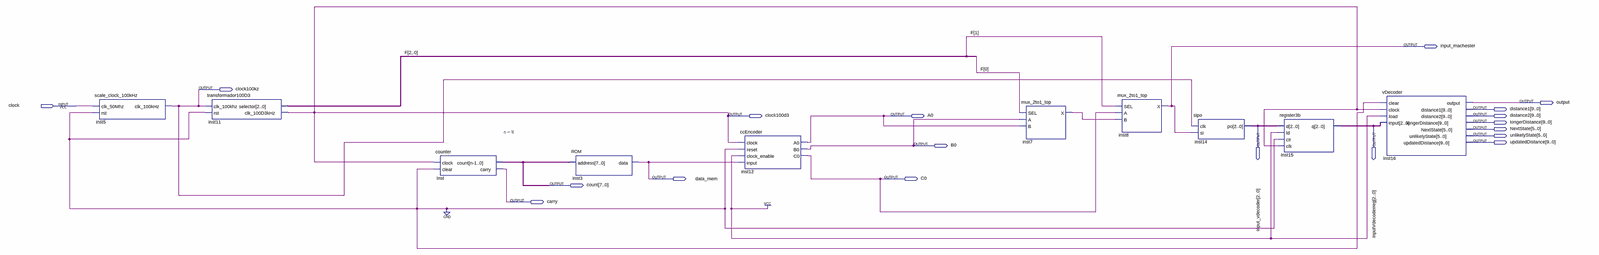
[diagram p0: schematic sheet, whole]
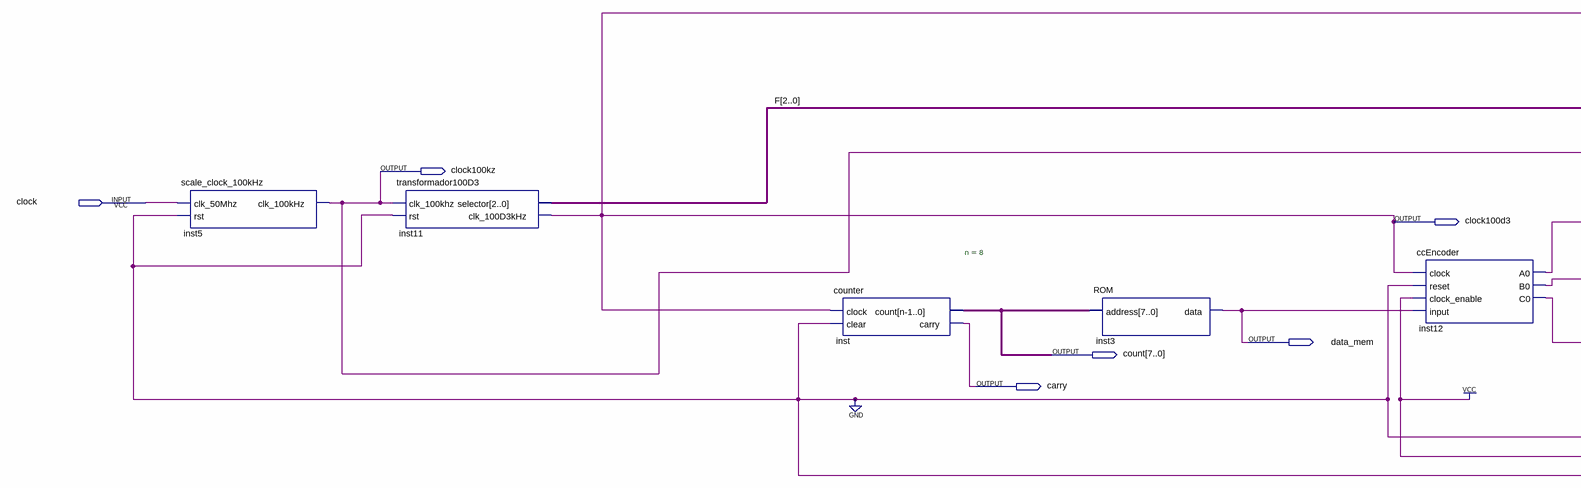
[diagram p1: schematic sheet, left part]
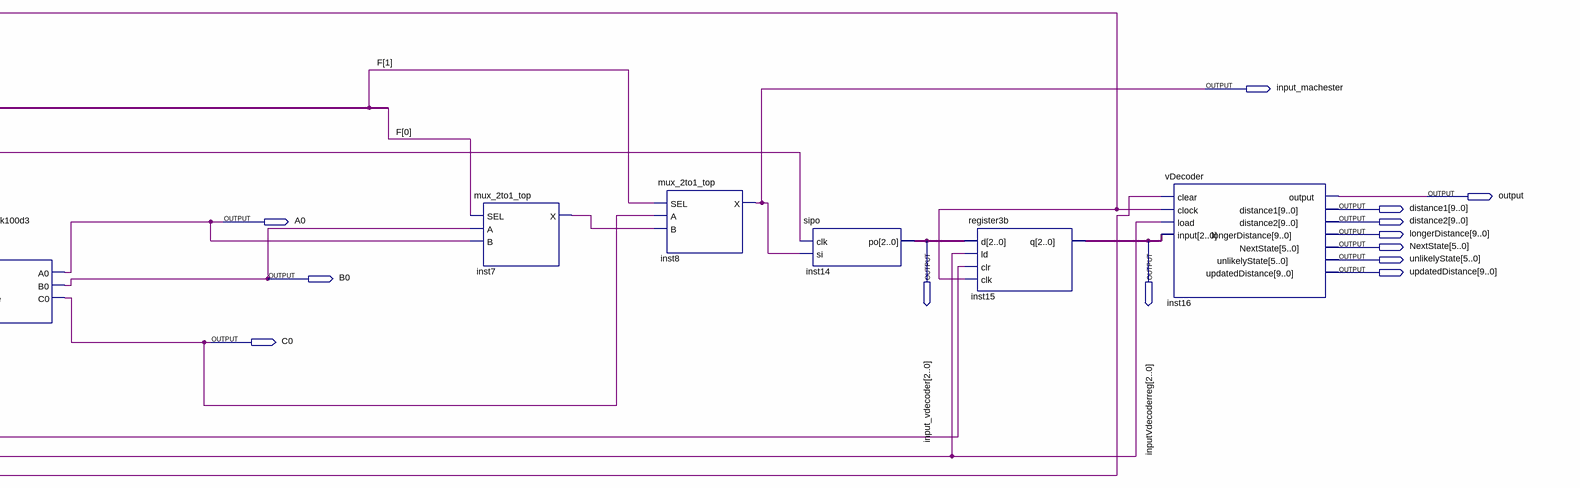
[diagram p2: schematic sheet, right part]
// Quartus schematic countmemconv.bdf as structural Verilog: 10 symbols, 19 pins
module countmemconv (
  input  clock,
  output input_machester,
  output clock100kz,
  output \output ,
  output [9:0] distance1,
  output clock100d3,
  output A0,
  output [9:0] distance2,
  output [9:0] longerDistance,
  output [2:0] input_vdecoder,
  output [2:0] inputVdecoderreg,
  output [5:0] NextState,
  output [5:0] unlikelyState,
  output [9:0] updatedDistance,
  output B0,
  output data_mem,
  output C0,
  output [7:0] count,
  output carry
);

  wire inst7_x;
  wire [2:0] F;

  scale_clock_100kHz inst5 (.clk_50Mhz(clock), .rst(1'b0), .clk_100kHz(clock100kz));
  transformador100D3 inst11 (.clk_100khz(clock100kz), .rst(1'b0), .selector(F), .clk_100D3kHz(clock100d3));
  counter #(.n(8)) inst (.clock(clock100d3), .clear(1'b0), .count(count), .carry(carry));
  ROM inst3 (.address(count), .data(data_mem));
  ccEncoder inst12 (
    .clock(clock100d3), .reset(1'b0), .clock_enable(1'b1), .\input (data_mem), .A0(A0), .B0(B0), .C0(C0));
  mux_2to1_top inst7 (.SEL(F[0]), .A(B0), .B(A0), .X(inst7_x));
  mux_2to1_top inst8 (.SEL(F[1]), .A(C0), .B(inst7_x), .X(input_machester));
  sipo inst14 (.clk(clock100kz), .si(input_machester), .po(input_vdecoder));
  register3b inst15 (.d(input_vdecoder), .ld(1'b1), .clr(1'b0), .clk(clock100d3), .q(inputVdecoderreg));
  vDecoder inst16 (
    .clear(1'b0), .clock(clock100d3), .load(1'b1), .\input (inputVdecoderreg), .\output (\output ),
    .distance1(distance1), .distance2(distance2), .longerDistance(longerDistance), .NextState(NextState),
    .unlikelyState(unlikelyState), .updatedDistance(updatedDistance));
endmodule
